# EAGLE design LedBoatController (EAGLE 9.6.2)
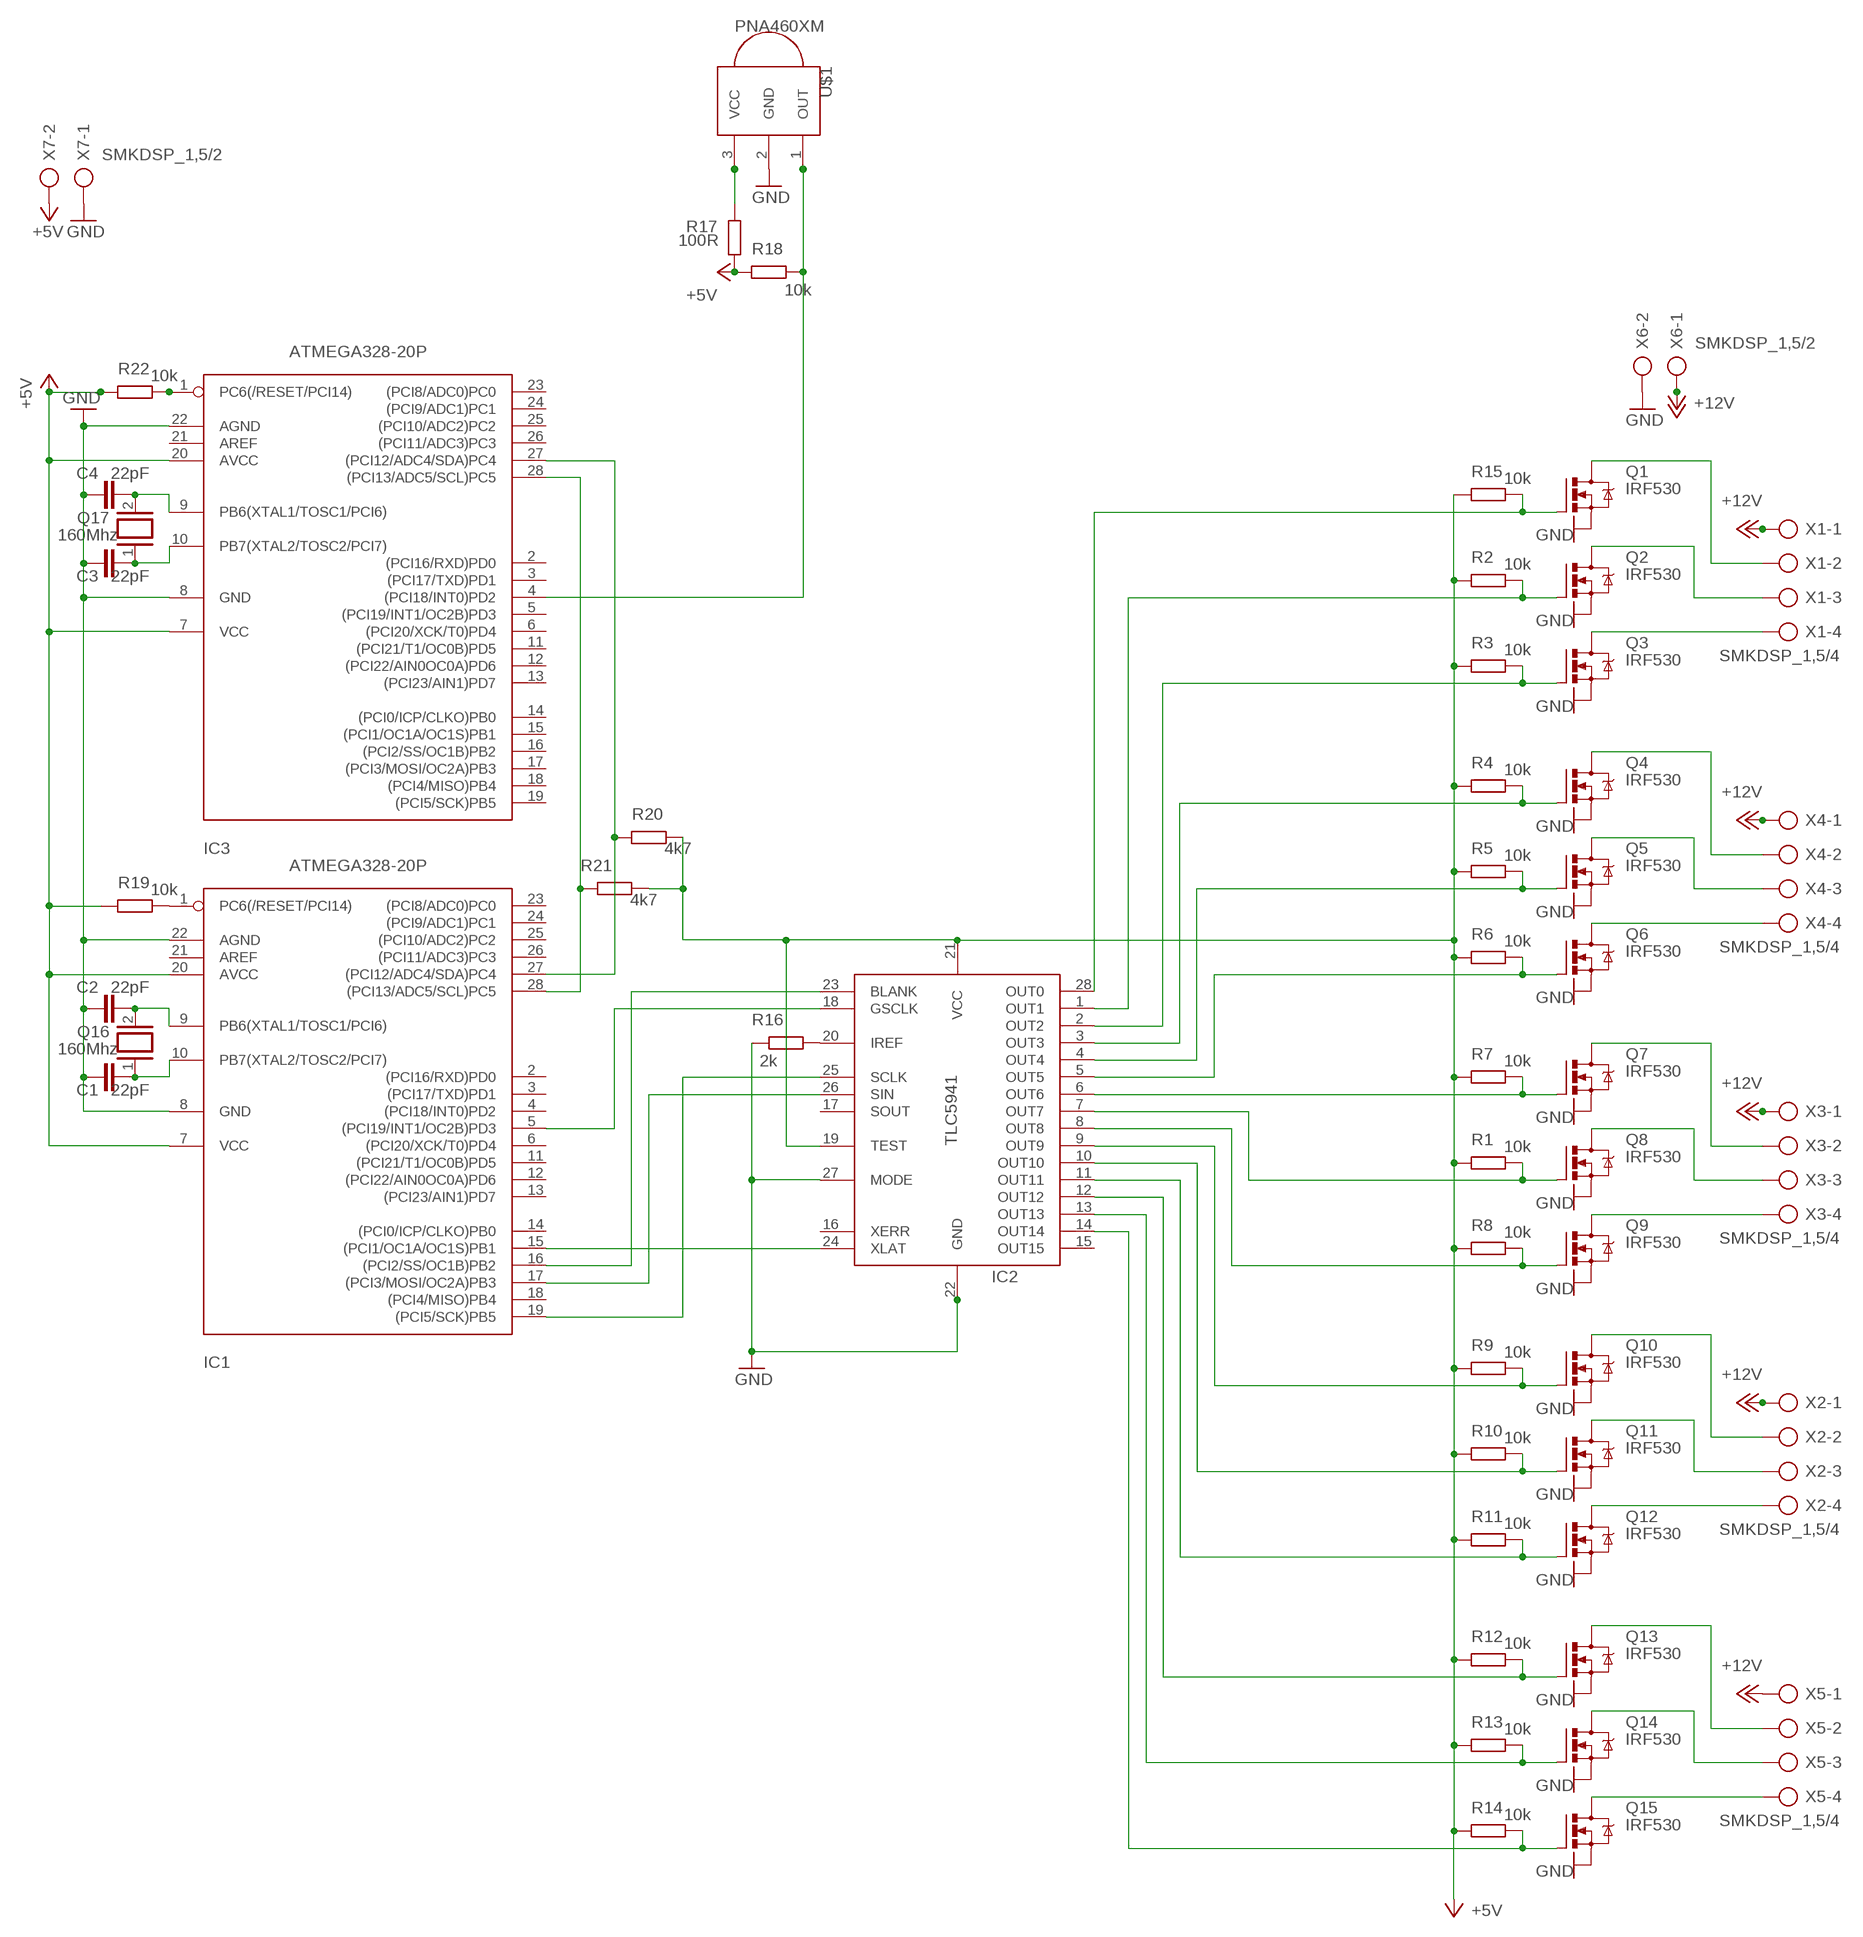
[diagram p0: schematic, sheet 1]

## Parts
C1  22pF  22PF-PTH-2.54MM-200V-5%  [CAP-PTH-2.54]
C2  22pF  22PF-PTH-2.54MM-200V-5%  [CAP-PTH-2.54]
C3  22pF  22PF-PTH-2.54MM-200V-5%  [CAP-PTH-2.54]
C4  22pF  22PF-PTH-2.54MM-200V-5%  [CAP-PTH-2.54]
IC1  ATMEGA328-20P  [DIL28-3]
IC2  TLC5941NT  [DIL28-3]
IC3  ATMEGA328-20P  [DIL28-3]
Q1  IRF530  [TO220BV]
Q2  IRF530  [TO220BV]
Q3  IRF530  [TO220BV]
Q4  IRF530  [TO220BV]
Q5  IRF530  [TO220BV]
Q6  IRF530  [TO220BV]
Q7  IRF530  [TO220BV]
Q8  IRF530  [TO220BV]
Q9  IRF530  [TO220BV]
Q10  IRF530  [TO220BV]
Q11  IRF530  [TO220BV]
Q12  IRF530  [TO220BV]
Q13  IRF530  [TO220BV]
Q14  IRF530  [TO220BV]
Q15  IRF530  [TO220BV]
Q16  160Mhz  XTAL/S  [QS]
Q17  160Mhz  XTAL/S  [QS]
R1  10k  R-EU_0207/10  [0207/10]
R2  10k  R-EU_0207/10  [0207/10]
R3  10k  R-EU_0207/10  [0207/10]
R4  10k  R-EU_0207/10  [0207/10]
R5  10k  R-EU_0207/10  [0207/10]
R6  10k  R-EU_0207/10  [0207/10]
R7  10k  R-EU_0207/10  [0207/10]
R8  10k  R-EU_0207/10  [0207/10]
R9  10k  R-EU_0207/10  [0207/10]
R10  10k  R-EU_0207/10  [0207/10]
R11  10k  R-EU_0207/10  [0207/10]
R12  10k  R-EU_0207/10  [0207/10]
R13  10k  R-EU_0207/10  [0207/10]
R14  10k  R-EU_0207/10  [0207/10]
R15  10k  R-EU_0207/10  [0207/10]
R16  2k  R-EU_0207/10  [0207/10]
R17  100R  R-EU_0207/10  [0207/10]
R18  10k  R-EU_0207/10  [0207/10]
R19  10k  R-EU_0207/10  [0207/10]
R20  4k7  R-EU_0207/10  [0207/10]
R21  4k7  R-EU_0207/10  [0207/10]
R22  10k  R-EU_0207/10  [0207/10]
U$1  PNA460XM  [PNA460XM]
X1  SMKDSP_1,5/4  [SMKDSP_1,5/4]
X2  SMKDSP_1,5/4  [SMKDSP_1,5/4]
X3  SMKDSP_1,5/4  [SMKDSP_1,5/4]
X4  SMKDSP_1,5/4  [SMKDSP_1,5/4]
X5  SMKDSP_1,5/4  [SMKDSP_1,5/4]
X6  SMKDSP_1,5/2  [SMKDSP_1,5/2]
X7  SMKDSP_1,5/2  [SMKDSP_1,5/2]

## Nets
+5V: IC1.7(VCC) IC1.20(AVCC) IC2.19(TEST) IC2.21(VCC) IC3.7(VCC) IC3.20(AVCC) R1.2 R2.2 R3.2 R4.2 R5.2 R6.2 R7.2 R8.2 R9.2 R10.2 R11.2 R12.2 R13.2 R14.2 R15.2 R17.2 R18.2 R19.2 R20.2 R21.2 R22.2 X7.2
+12V: X1.1 X2.1 X3.1 X4.1 X5.1 X6.1
GND: C1.1 C2.1 C3.1 C4.1 IC1.8(GND) IC1.22(AGND) IC2.22(GND) IC2.27(MODE) IC3.8(GND) IC3.22(AGND) Q1.S Q2.S Q3.S Q4.S Q5.S Q6.S Q7.S Q8.S Q9.S Q10.S Q11.S Q12.S Q13.S Q14.S Q15.S R16.2 U$1.2(GND) X6.2 X7.1
N$1: IC2.28(OUT0) Q1.G R15.1
N$2: C1.2 IC1.10(PB7(XTAL2/TOSC2/PCI7)) Q16.1
N$3: IC2.1(OUT1) Q2.G R2.1
N$4: IC2.2(OUT2) Q3.G R3.1
N$5: IC2.3(OUT3) Q4.G R4.1
N$6: IC2.4(OUT4) Q5.G R5.1
N$7: IC2.5(OUT5) Q6.G R6.1
N$8: IC2.6(OUT6) Q7.G R7.1
N$9: IC2.7(OUT7) Q8.G R1.1
N$10: IC2.8(OUT8) Q9.G R8.1
N$11: IC2.9(OUT9) Q10.G R9.1
N$12: IC2.10(OUT10) Q11.G R10.1
N$13: IC2.11(OUT11) Q12.G R11.1
N$14: IC2.12(OUT12) Q13.G R12.1
N$15: IC2.13(OUT13) Q14.G R13.1
N$16: IC2.14(OUT14) Q15.G R14.1
N$17: Q15.D X5.4
N$18: Q14.D X5.3
N$19: Q13.D X5.2
N$20: Q12.D X2.4
N$21: Q11.D X2.3
N$22: Q10.D X2.2
N$23: Q9.D X3.4
N$24: Q8.D X3.3
N$25: Q7.D X3.2
N$26: Q6.D X4.4
N$27: Q5.D X4.3
N$28: Q4.D X4.2
N$29: Q3.D X1.4
N$30: Q2.D X1.3
N$31: Q1.D X1.2
N$32: C2.2 IC1.9(PB6(XTAL1/TOSC1/PCI6)) Q16.2
N$34: IC1.15((PCI1/OC1A/OC1S)PB1) IC2.24(XLAT)
N$36: IC1.17((PCI3/MOSI/OC2A)PB3) IC2.26(SIN)
N$38: IC1.16((PCI2/SS/OC1B)PB2) IC2.23(BLANK)
N$39: IC1.19((PCI5/SCK)PB5) IC2.25(SCLK)
N$40: IC2.20(IREF) R16.1
N$41: IC1.1(PC6(/RESET/PCI14)) R19.1
N$42: IC1.5((PCI19/INT1/OC2B)PD3) IC2.18(GSCLK)
N$43: R17.1 U$1.3(VCC)
N$44: C3.2 IC3.10(PB7(XTAL2/TOSC2/PCI7)) Q17.1
N$45: C4.2 IC3.9(PB6(XTAL1/TOSC1/PCI6)) Q17.2
N$46: IC1.27((PCI12/ADC4/SDA)PC4) IC3.27((PCI12/ADC4/SDA)PC4) R20.1
N$47: IC3.1(PC6(/RESET/PCI14)) R22.1
N$48: IC3.4((PCI18/INT0)PD2) R18.1 U$1.1(OUT)
N$51: IC1.28((PCI13/ADC5/SCL)PC5) IC3.28((PCI13/ADC5/SCL)PC5) R21.1
Unconnected: IC1.2((PCI16/RXD)PD0) IC1.3((PCI17/TXD)PD1) IC1.4((PCI18/INT0)PD2) IC1.6((PCI20/XCK/T0)PD4) IC1.11((PCI21/T1/OC0B)PD5) IC1.12((PCI22/AIN0OC0A)PD6) IC1.13((PCI23/AIN1)PD7) IC1.14((PCI0/ICP/CLKO)PB0) IC1.18((PCI4/MISO)PB4) IC1.21(AREF) IC1.23((PCI8/ADC0)PC0) IC1.24((PCI9/ADC1)PC1) IC1.25((PCI10/ADC2)PC2) IC1.26((PCI11/ADC3)PC3) IC2.15(OUT15) IC2.16(XERR) IC2.17(SOUT) IC3.2((PCI16/RXD)PD0) IC3.3((PCI17/TXD)PD1) IC3.5((PCI19/INT1/OC2B)PD3) IC3.6((PCI20/XCK/T0)PD4) IC3.11((PCI21/T1/OC0B)PD5) IC3.12((PCI22/AIN0OC0A)PD6) IC3.13((PCI23/AIN1)PD7) IC3.14((PCI0/ICP/CLKO)PB0) IC3.15((PCI1/OC1A/OC1S)PB1) IC3.16((PCI2/SS/OC1B)PB2) IC3.17((PCI3/MOSI/OC2A)PB3) IC3.18((PCI4/MISO)PB4) IC3.19((PCI5/SCK)PB5) IC3.21(AREF) IC3.23((PCI8/ADC0)PC0) IC3.24((PCI9/ADC1)PC1) IC3.25((PCI10/ADC2)PC2) IC3.26((PCI11/ADC3)PC3)

## Library data of the parts
C1-C4 = SparkFun-Capacitors:22PF: 22pF ceramic capacitors A capacitor is a passive two-terminal electrical component used to store electrical energy temporarily in an electric field.; PROD_ID: CAP-09128
IC1 IC3 = atmega328:ATMEGA328*P: MICROCONTROLLER 32 kBytes FLASH 2 kBytes SRAM 1 kBytes EEPROM USART 8-channel 10 bit ADC
IC2 = adafruit:TLC5941
Q1-Q15 = transistor-power:IRF530: HEXFET Power MOSFET
Q16 Q17 = special:XTAL/S: CRYSTAL
R1-R22 = rcl:R-EU_: RESISTOR, European symbol; SPICEPREFIX: R
U$1 = adafruit:PNA460XM: IR 38KHz receiver PNA4602 and related receivers http://www.ladyada.net/library/pcb/eaglelibrary.html
X1-X5 = con-phoenix-smkdsp:SMKDSP_1,5/4: Printklemme, Nennstrom: 17,5 A, Bemessungsspannung: 250 V, Raster: 5,0 mm Source: http://eshop.phoenixcontact.de .. 1733415.pdf; MF: FARNELL; MPN: 1733596; OC_FARNELL: 3041268; OC_NEWARK: 71C4131
X6 X7 = con-phoenix-smkdsp:SMKDSP_1,5/2: Printklemme, Nennstrom: 17,5 A, Bemessungsspannung: 250 V, Raster: 5,0 mm Source: http://eshop.phoenixcontact.de .. 1733415.pdf; MF: FARNELL; MPN: 1733570; OC_FARNELL: 3041244; OC_NEWARK: 69C8588

## Board
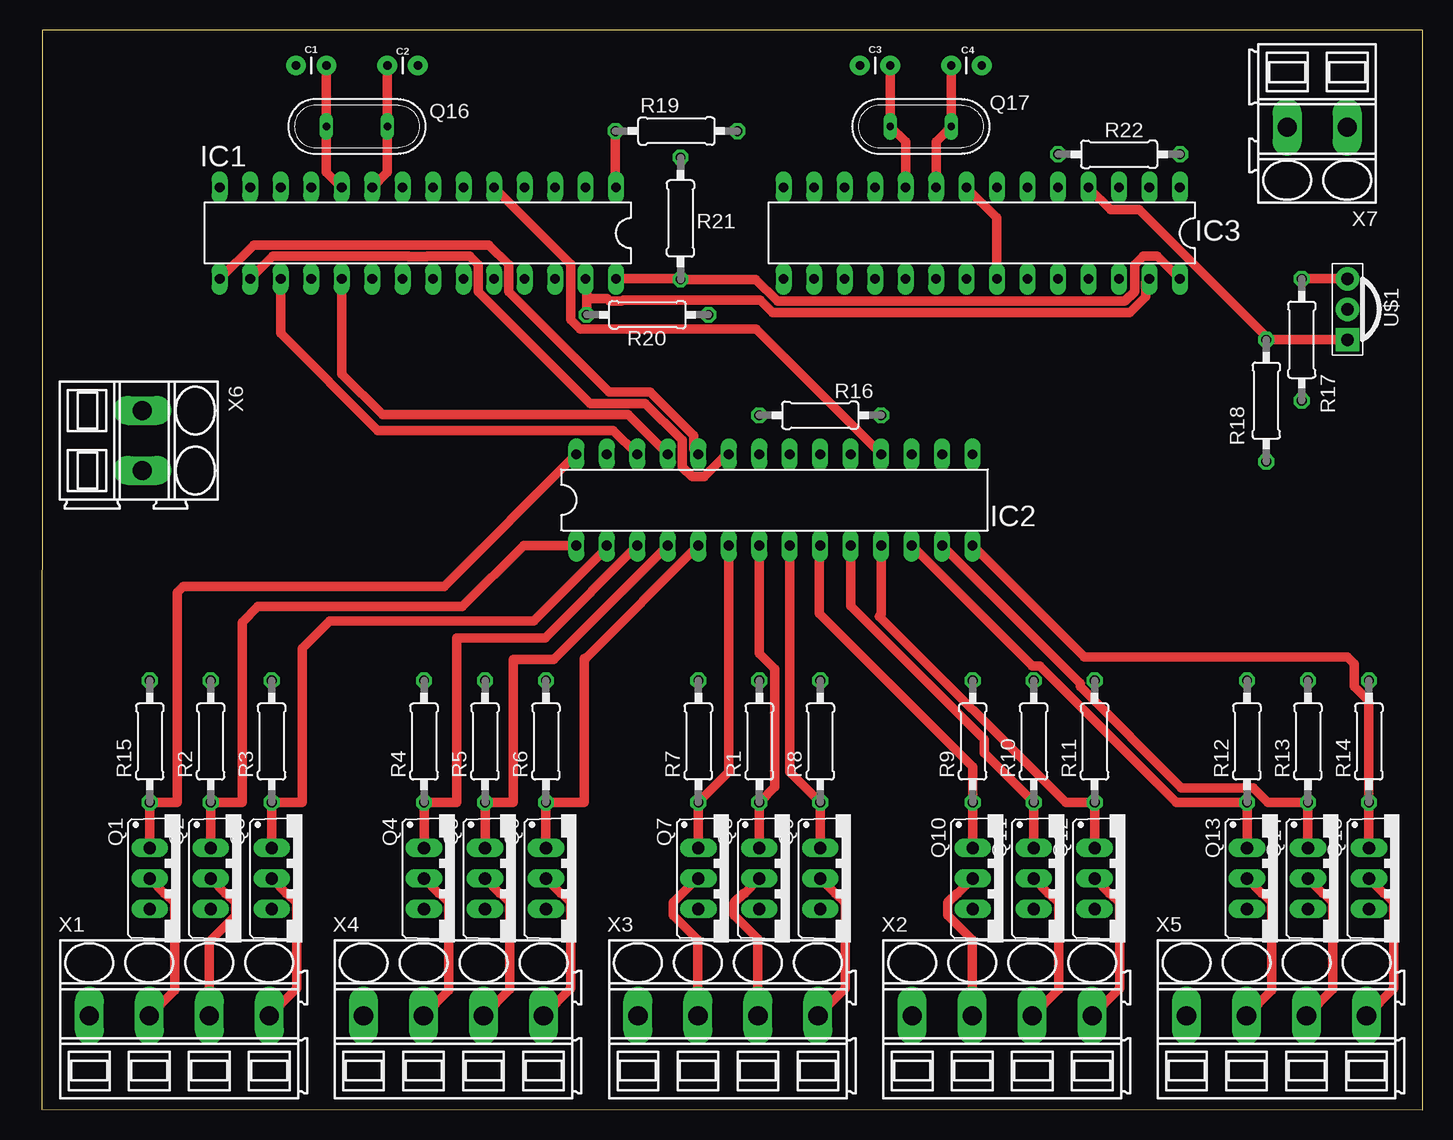
[diagram p1: board, top side]
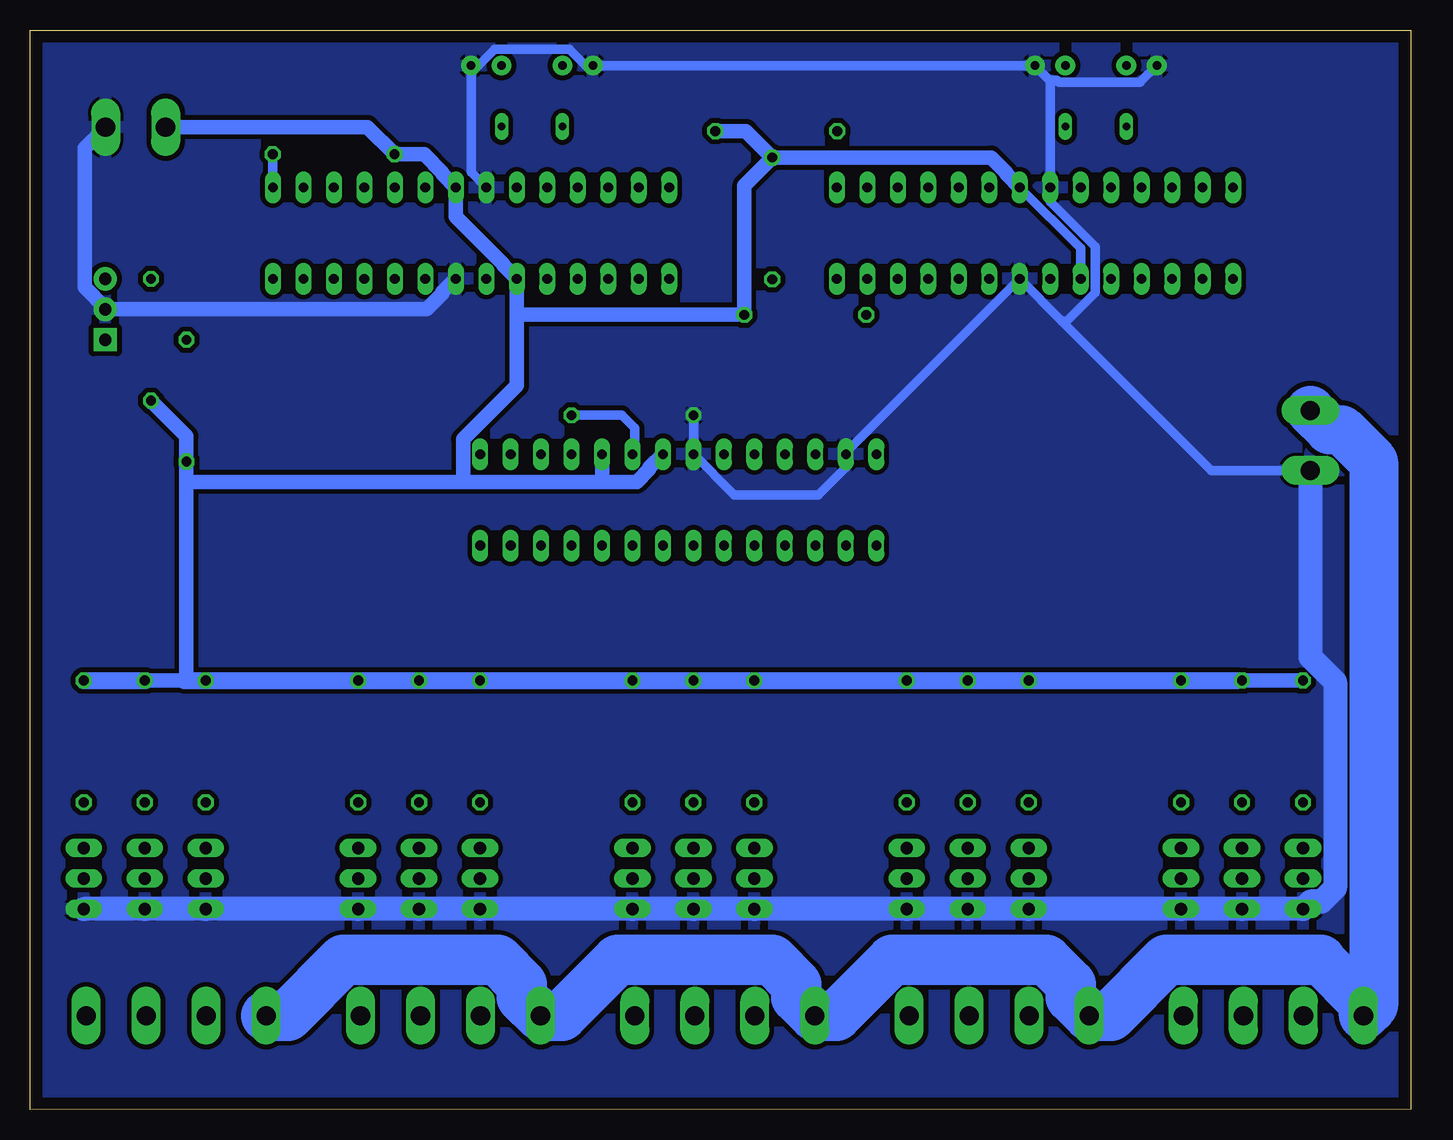
[diagram p2: board, bottom side, seen from below]

Size 115.07 x 90 mm. Coordinates in mm from the lower left corner, seen from the top.
Outline: 0,0.01 115.07,0 115.07,90 0.01,89.97 0,0.01
Copper layers (1*16): Top 0.035mm / dielectric 1.5mm / Bottom 0.035mm
Design rules "default *": minimum track width 0.8mm, minimum drill 0.35mm, track to track 16mil, track to pad 16mil, pad to pad 16mil, via to via 16mil, smd to smd 6mil, copper to edge 40mil, drill to drill 6mil, minimum pad ring 10mil, minimum via ring 8mil, stop-mask expansion 4mil, vias tented up to drill 0mil, thermal gap 10mil

### Footprints (pad centres in the part's own frame; a part is rotated, then mirrored left to right if it is on the bottom)
CAP-PTH-2.54 = drill 0.7 pad 1.651: 1 -1.27,0; 2 1.27,0
DIL28-3 = drill 0.813 long: 1 -16.51,-3.81; 2 -13.97,-3.81; 3 -11.43,-3.81; 4 -8.89,-3.81; 5 -6.35,-3.81; 6 -3.81,-3.81; 7 -1.27,-3.81; 8 1.27,-3.81; 9 3.81,-3.81; 10 6.35,-3.81; 11 8.89,-3.81; 12 11.43,-3.81; 13 13.97,-3.81; 14 16.51,-3.81; 15 16.51,3.81; 16 13.97,3.81; 17 11.43,3.81; 18 8.89,3.81; 19 6.35,3.81; 20 3.81,3.81; 21 1.27,3.81; 22 -1.27,3.81; 23 -3.81,3.81; 24 -6.35,3.81; 25 -8.89,3.81; 26 -11.43,3.81; 27 -13.97,3.81; 28 -16.51,3.81
TO220BV = drill 1.016 long: D 0,-2.54; G -2.54,-2.54; S 2.54,-2.54
QS = drill 0.61 long: 1 -2.54,0; 2 2.54,0
0207/10 = drill 0.813 octagon: 1 -5.08,0; 2 5.08,0
PNA460XM = drill 1.016 pad 1.93 square: 1 -2.54,0 | drill 1.016 pad 1.93: 2 0,0; 3 2.54,0
SMKDSP_1,5/4 = drill 1.6 pad 1.8 long: 1 -2.5,0; 2 2.5,0; 3 7.5,0; 4 12.5,0
SMKDSP_1,5/2 = drill 1.6 pad 1.8 long: 1 -2.5,0; 2 2.5,0

### Placement (x,y rotation side)
C1  22.44,87.03 0 top
C2  30.06,87.03 180 top
C3  69.43,87.03 0 top
C4  77.05,87.03 180 top
IC1  31.33,73.06 180 top
IC2  61.05,50.82 0 top
IC3  78.32,73.06 180 top
Q1  11.52,19.25 270 top
Q2  16.6,19.25 270 top
Q3  21.68,19.25 270 top
Q4  34.38,19.25 270 top
Q5  39.46,19.25 270 top
Q6  44.54,19.25 270 top
Q7  57.24,19.25 270 top
Q8  62.32,19.25 270 top
Q9  67.4,19.25 270 top
Q10  80.1,19.25 270 top
Q11  85.18,19.25 270 top
Q12  90.26,19.25 270 top
Q13  102.96,19.25 270 top
Q14  108.04,19.25 270 top
Q15  113.12,19.25 270 top
Q16  26.25,81.95 0 top
Q17  73.24,81.95 0 top
R1  59.78,30.68 90 top
R2  14.06,30.68 90 top
R3  19.14,30.68 90 top
R4  31.84,30.68 90 top
R5  36.92,30.68 90 top
R6  42,30.68 90 top
R7  54.7,30.68 90 top
R8  64.86,30.68 90 top
R9  77.56,30.68 90 top
R10  82.64,30.68 90 top
R11  87.72,30.68 90 top
R12  100.42,30.68 90 top
R13  105.5,30.68 90 top
R14  110.58,30.68 90 top
R15  8.98,30.68 90 top
R16  64.86,57.88 180 top
R17  104.99,64.17 270 top
R18  102.03,59.09 270 top
R19  52.87,81.57 0 top
R20  50.46,66.25 0 top
R21  53.22,74.29 90 top
R22  89.76,79.64 180 top
U$1  108.8,66.71 90 top
X1  6.44,7.82 0 top
X2  75.02,7.82 0 top
X3  52.16,7.82 0 top
X4  29.3,7.82 0 top
X5  97.88,7.82 0 top
X6  8.37,55.77 270 top
X7  106.27,81.9 180 top

### Tracks (layer width: path | path; a pad name or v marks a point on that pad's centre or on a via)
+5V
  Bottom 0.8: 14.49,35.76 R2.2 | IC1.7 27.52,71.79 IC1.20 | R18.2 102.03,52.32
  Bottom 1.2: IC2.21 63.44,53.5 63.44,53.39 64.51,52.32 67.69,52.32 | 67.69,52.32 79.19,52.32 | 79.19,52.32 102.03,52.32 | 67.69,52.32 67.4,52.61 IC2.19 | 79.19,52.32 78.97,52.54 78.97,55.88 74.51,60.34 74.51,66.02 | 14.49,35.76 R15.2 R2.2 | 74.51,66.02 IC3.20 75.63,70.38 75.63,70.5 79.59,74.45 IC3.7 80.71,78 80.71,78.12 82.23,79.64 R22.2 86.95,81.9 X7.2 | 74.51,66.02 74.27,66.25 R20.2 55.54,77.04 R21.2 | R21.2 55.42,81.57 R19.2 | IC1.7 33.72,78 33.72,78.12 34.97,79.37 R21.2 | R17.2 102.03,56.14 R18.2 102.03,35.92 102.19,35.76 R13.2
  Bottom 1.4: R14.2 R13.2 | 102.19,35.76 R12.2 R11.2 R10.2 R9.2 R8.2 R1.2 R7.2 R6.2 R5.2 R4.2 R3.2 14.49,35.76
+12V
  Bottom 4.1: X6.1 6.77,56.68 5.76,56.68 3.11,54.02 3.11,8.66 X1.1 3.94,8.9 7.51,12.47
  Bottom 4.2: 7.51,12.47 20.37,12.47 25.03,7.82 X4.1 28.35,9.37 28.35,10.45 30.37,12.47 43.23,12.47 47.89,7.82 X3.1 51.21,9.37 51.21,10.45 53.23,12.47 66.09,12.47 70.75,7.82 X2.1 74.07,9.37 74.07,10.45 76.09,12.47 88.95,12.47 93.61,7.82 X5.1
GND
  Top 0.8: IC3.8 79.59,74.33 IC3.22
  Bottom 0.8: 29.07,65.73 16.62,53.27 X6.2 | C2.1 30.06,85.76 IC1.8 30.06,75.68 26.3,71.93 26.3,68.09 28.66,65.73 29.07,65.73 | C2.1 C3.1 68.75,87.03 70.13,88.41 76.35,88.41 77.72,87.03 C4.1 78.32,78.14 IC3.8 | 29.07,65.73 IC1.22 47.08,54.77 IC2.27 47.08,53.53 49.39,51.22 56.37,51.22 IC2.22 R16.2 | C1.1 22.53,85.67 22.53,85.66 29.36,85.66 29.52,85.82 30.11,85.82 C2.1
  Bottom 1.2: X7.1 110.51,80.15 110.51,68.54 108.8,66.83 U$1.2 82.01,66.71 80.71,68.01 80.71,68.13 IC3.22
  Bottom 2: X6.2 8.37,37.71 6.31,35.65 6.31,18.46 7.43,17.34 8.36,17.34 Q1.S Q2.S Q3.S Q4.S Q5.S Q6.S Q7.S Q8.S Q9.S Q10.S Q11.S Q12.S Q13.S Q14.S Q15.S
  pour Bottom (isolate 0.305): -0.21,90.32 115.39,90.32 115.49,90.22 115.79,89.92 115.79,-0.48 115.59,-0.68 -0.61,-0.68 -0.61,89.82 -0.21,90.22
N$1
  Top 0.8: IC2.28 33.53,43.62 11.79,43.62 11.29,43.12 11.29,25.62 11.27,25.6 R15.1 Q1.G
N$2
  Top 0.8: IC1.10 23.71,78.14 Q16.1 C1.2
N$3
  Top 0.8: IC2.1 40.14,47.01 35.05,41.92 17.99,41.92 16.69,40.62 16.69,25.62 16.67,25.6 R2.1 Q2.G
N$4
  Top 0.8: IC2.2 47.08,46.81 40.99,40.72 23.99,40.72 21.69,38.42 21.69,25.62 21.67,25.6 R3.1 Q3.G
N$5
  Top 0.8: IC2.3 41.93,39.32 34.59,39.32 34.59,25.62 34.57,25.6 R4.1 Q4.G
N$6
  Top 0.8: IC2.4 42.67,37.52 39.29,37.52 39.29,25.62 39.27,25.6 R5.1 Q5.G
N$7
  Top 0.8: Q6.G R6.1 45.17,25.6 45.19,25.62 45.19,37.62 45.31,37.62 IC2.5
N$8
  Top 0.8: Q7.G R7.1 57.24,28.13 IC2.6
N$9
  Top 0.8: IC2.7 59.78,38.03 61.09,36.72 61.09,26.88 59.8,25.6 R1.1 Q8.G
N$10
  Top 0.8: Q9.G R8.1 62.32,28.15 IC2.8
N$11
  Top 0.8: IC2.9 64.76,46.91 64.76,41.35 77.56,28.54 R9.1 Q10.G
N$12
  Top 0.8: IC2.10 67.4,41.98 67.39,41.97 78.52,30.84 78.52,29.73 R10.1 Q11.G
N$13
  Top 0.8: IC2.11 69.94,41.27 69.79,41.12 85.31,25.6 R11.1 Q12.G
N$14
  Top 0.8: Q13.G R12.1 94.52,25.6 83.15,36.97 82.51,36.97 IC2.12
N$15
  Top 0.8: Q14.G R13.1 102.14,25.6 100.93,26.81 94.96,26.81 86.51,35.26 86.51,35.52 IC2.13
N$16
  Top 0.8: Q15.G R14.1 110.58,34.05 109.37,35.26 109.37,37.14 108.79,37.72 86.85,37.72 IC2.14
N$17
  Top 0.8: Q15.D 111.81,18.03 111.89,18.03 112.66,17.26 112.66,10.1 X5.4
N$18
  Top 0.8: Q14.D 106.73,18.03 106.81,18.03 107.58,17.26 107.58,10.02 X5.3
N$19
  Top 0.8: Q13.D 101.65,18.03 101.73,18.03 102.5,17.26 102.5,9.94 X5.2
N$20
  Top 0.8: Q12.D 88.95,18.03 89.03,18.03 89.8,17.26 89.8,10.1 X2.4
N$21
  Top 0.8: Q11.D 83.87,18.03 83.95,18.03 84.72,17.26 84.72,10.02 X2.3
N$22
  Top 0.8: Q10.D 76.34,18.03 76.26,18.03 75.49,17.26 75.49,16.17 77.52,14.13 X2.2
N$23
  Top 0.8: Q9.D 66.09,18.03 66.17,18.03 66.94,17.26 66.94,10.1 X3.4
N$24
  Top 0.8: X3.3 59.66,14.21 57.71,16.17 57.71,17.26 58.48,18.03 58.56,18.03 Q8.D
N$25
  Top 0.8: X3.2 54.66,14.13 52.63,16.17 52.63,17.26 54.62,19.25 Q7.D
N$26
  Top 0.8: Q6.D 43.23,18.03 43.31,18.03 44.08,17.26 44.08,10.1 X4.4
N$27
  Top 0.8: Q5.D 38.15,18.03 38.23,18.03 39,17.26 39,10.02 X4.3
N$28
  Top 0.8: Q4.D 33.07,18.03 33.15,18.03 33.92,17.26 33.92,9.94 X4.2
N$29
  Top 0.8: Q3.D 20.37,18.03 20.45,18.03 21.22,17.26 21.22,10.1 X1.4
N$30
  Top 0.8: Q2.D 15.29,18.03 15.37,18.03 16.14,17.26 16.14,16.17 13.94,13.97 X1.3
N$31
  Top 0.8: Q1.D 10.21,18.03 10.29,18.03 11.06,17.26 11.06,9.94 X1.2
N$32
  Top 0.8: IC1.9 28.79,78.14 Q16.2 C2.2
N$34
  Top 0.8: IC2.24 54.32,55.01 54.32,56.19 50.68,59.83 47.27,59.83 38.89,68.21 38.89,70.42 37.23,72.08 17.64,72.08 IC1.15
N$36
  Top 0.8: IC2.26 47.63,56.62 27.99,56.62 19.9,64.71 IC1.17
N$38
  Top 0.8: IC2.23 57.07,54.63 55.2,52.76 54.19,52.76 53.37,53.58 53.37,55.79 50.29,58.87 45.68,58.87 36.35,68.21 36.35,70.42 35.64,71.13 32.09,71.13 32.09,71.12 30.56,71.12 30.56,71.13 19.23,71.13 IC1.16
N$39
  Top 0.8: IC2.25 48.87,57.92 28.39,57.92 24.98,61.33 IC1.19
N$40
  Bottom 0.8: R16.1 65.74,57.88 64.69,56.82 64.69,54.8 IC2.20
N$41
  Top 0.8: R19.1 47.8,76.91 IC1.1
N$42
  Top 0.8: IC1.5 44.08,70.47 44.08,65.84 44.88,65.04 59.53,65.04 IC2.18
N$43
  Top 0.8: R17.1 U$1.3
N$44
  Top 0.8: IC3.10 71.97,80.68 Q17.1 C3.2
N$45
  Top 0.8: IC3.9 74.51,80.68 Q17.2 C4.2
N$46
  Top 0.8: IC1.27 45.38,69.17 45.38,67.62 | 45.38,67.62 R20.1 | 45.38,67.62 47.09,67.62 47.33,67.38 48.34,67.38 48.42,67.47 59.87,67.47 60.91,66.43 90.64,66.43 92,67.79 92,68.97 IC3.27
N$47
  Bottom 0.8: R22.1 94.85,76.89 IC3.1
N$48
  Top 0.8: U$1.1 R18.1 102.03,64.43 91.45,75 89.08,75 IC3.4
N$51
  Top 0.8: IC1.28 53.17,69.25 R21.1 59.48,69.21 61.3,67.38 90.25,67.38 91.05,68.18 91.05,69.62 91.07,69.65 91.07,70.42 91.78,71.13 92.95,71.13 IC3.28